# Altium schematic sheet MCU.SchDoc: Microcontroller
size A4; SheetNumber: 3; SheetTotal: 6
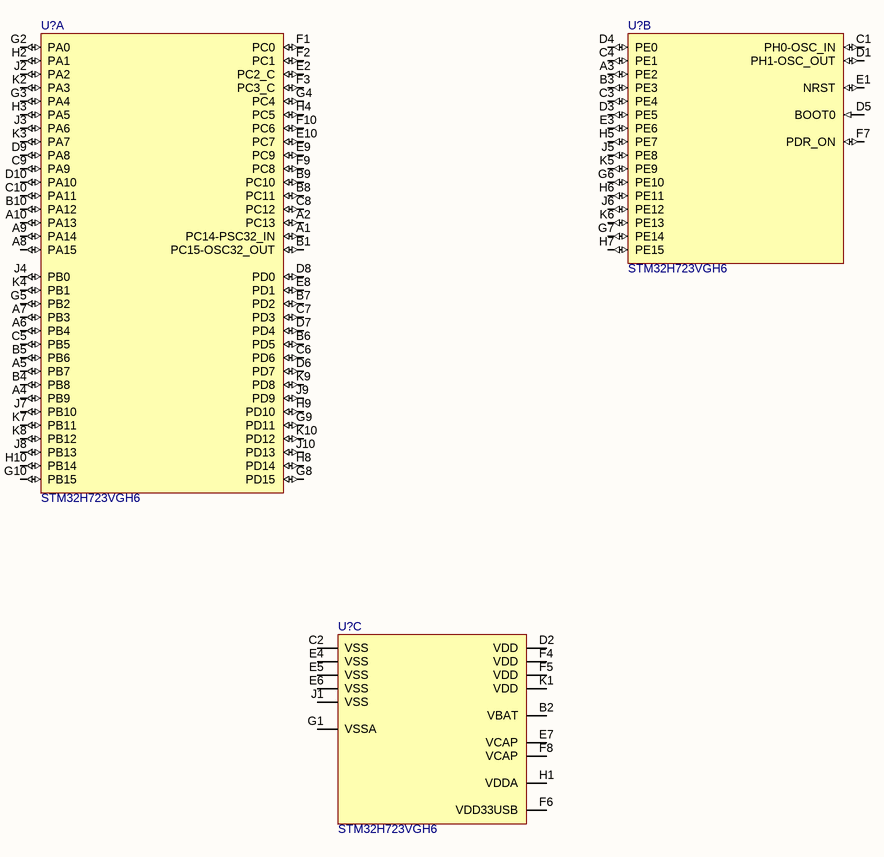
[diagram p0: MCU.SchDoc]

## Parts
(Parts that share a designator on the sheet are numbered #1, #2 ... from top to bottom, then left to right.)
U?#1  STM32H723VGH6  [TFBGA100_STM]  (part B of 3)
U?#2  STM32H723VGH6  [TFBGA100_STM]  (part A of 3)
U?#3  STM32H723VGH6  [TFBGA100_STM]  (part C of 3)

## Nets

Not connected (* = marked no-connect by the designer): U?#1 A3(PE2) B3(PE3) C1(PH0-OSC_IN) C3(PE4) C4(PE1) D1(PH1-OSC_OUT) D3(PE5) D4(PE0) D5(BOOT0) E1(NRST) E3(PE6) F7(PDR_ON) G6(PE10) G7(PE14) H5(PE7) H6(PE11) H7(PE15) J5(PE8) J6(PE12) K5(PE9) K6(PE13); U?#2 A1(PC14-PSC32_IN) A2(PC13) A4(PB9) A5(PB7) A6(PB4) A7(PB3) A8(PA15) A9(PA14) A10(PA13) B1(PC15-OSC32_OUT) B4(PB8) B5(PB6) B6(PD5) B7(PD2) B8(PC11) B9(PC10) B10(PA12) C5(PB5) C6(PD6) C7(PD3) C8(PC12) C9(PA9) C10(PA11) D6(PD7) D7(PD4) D8(PD0) D9(PA8) D10(PA10) E2(PC2_C) E8(PD1) E9(PC9) E10(PC7) F1(PC0) F2(PC1) F3(PC3_C) F9(PC8) F10(PC6) G2(PA0) G3(PA4) G4(PC4) G5(PB2) G8(PD15) G9(PD11) G10(PB15) H2(PA1) H3(PA5) H4(PC5) H8(PD14) H9(PD10) H10(PB14) J2(PA2) J3(PA6) J4(PB0) J7(PB10) J8(PB13) J9(PD9) J10(PD13) K2(PA3) K3(PA7) K4(PB1) K7(PB11) K8(PB12) K9(PD8) K10(PD12); U?#3 B2(VBAT) C2(VSS) D2(VDD) E4(VSS) E5(VSS) E6(VSS) E7(VCAP) F4(VDD) F5(VDD) F6(VDD33USB) F8(VCAP) G1(VSSA) H1(VDDA) J1(VSS) K1(VDD)

## Notes on the sheet
- TITLE
- DRAWN BY
- DATE
- PROJECT
- FILE
- SHEET SIZE
- A4
- REVISION
- PAGE
- of

## Library data of the parts
U?#1-U?#3 = STM32H723VGH6: ARM® Cortex®-M7 STM32H7 Microcontroller IC 32-Bit Single-Core 550MHz 1MB (1M x 8) FLASH 100-TFBGA (8x8); Manufacturer_Part_Number: STM32H723VGH6; Supplier 1: Digi-Key; Supplier 2: Mouser; Supplier 3: LCSC; Supplier Part Number 1: 497-STM32H723VGH6-ND; Supplier Part Number 2: 511-STM32H723VGH6; Supplier Part Number 3: C2848033